# Altium schematic sheet PLL.SchDoc
size 420 x 297 mm; SheetNumber: 4; SheetTotal: 6
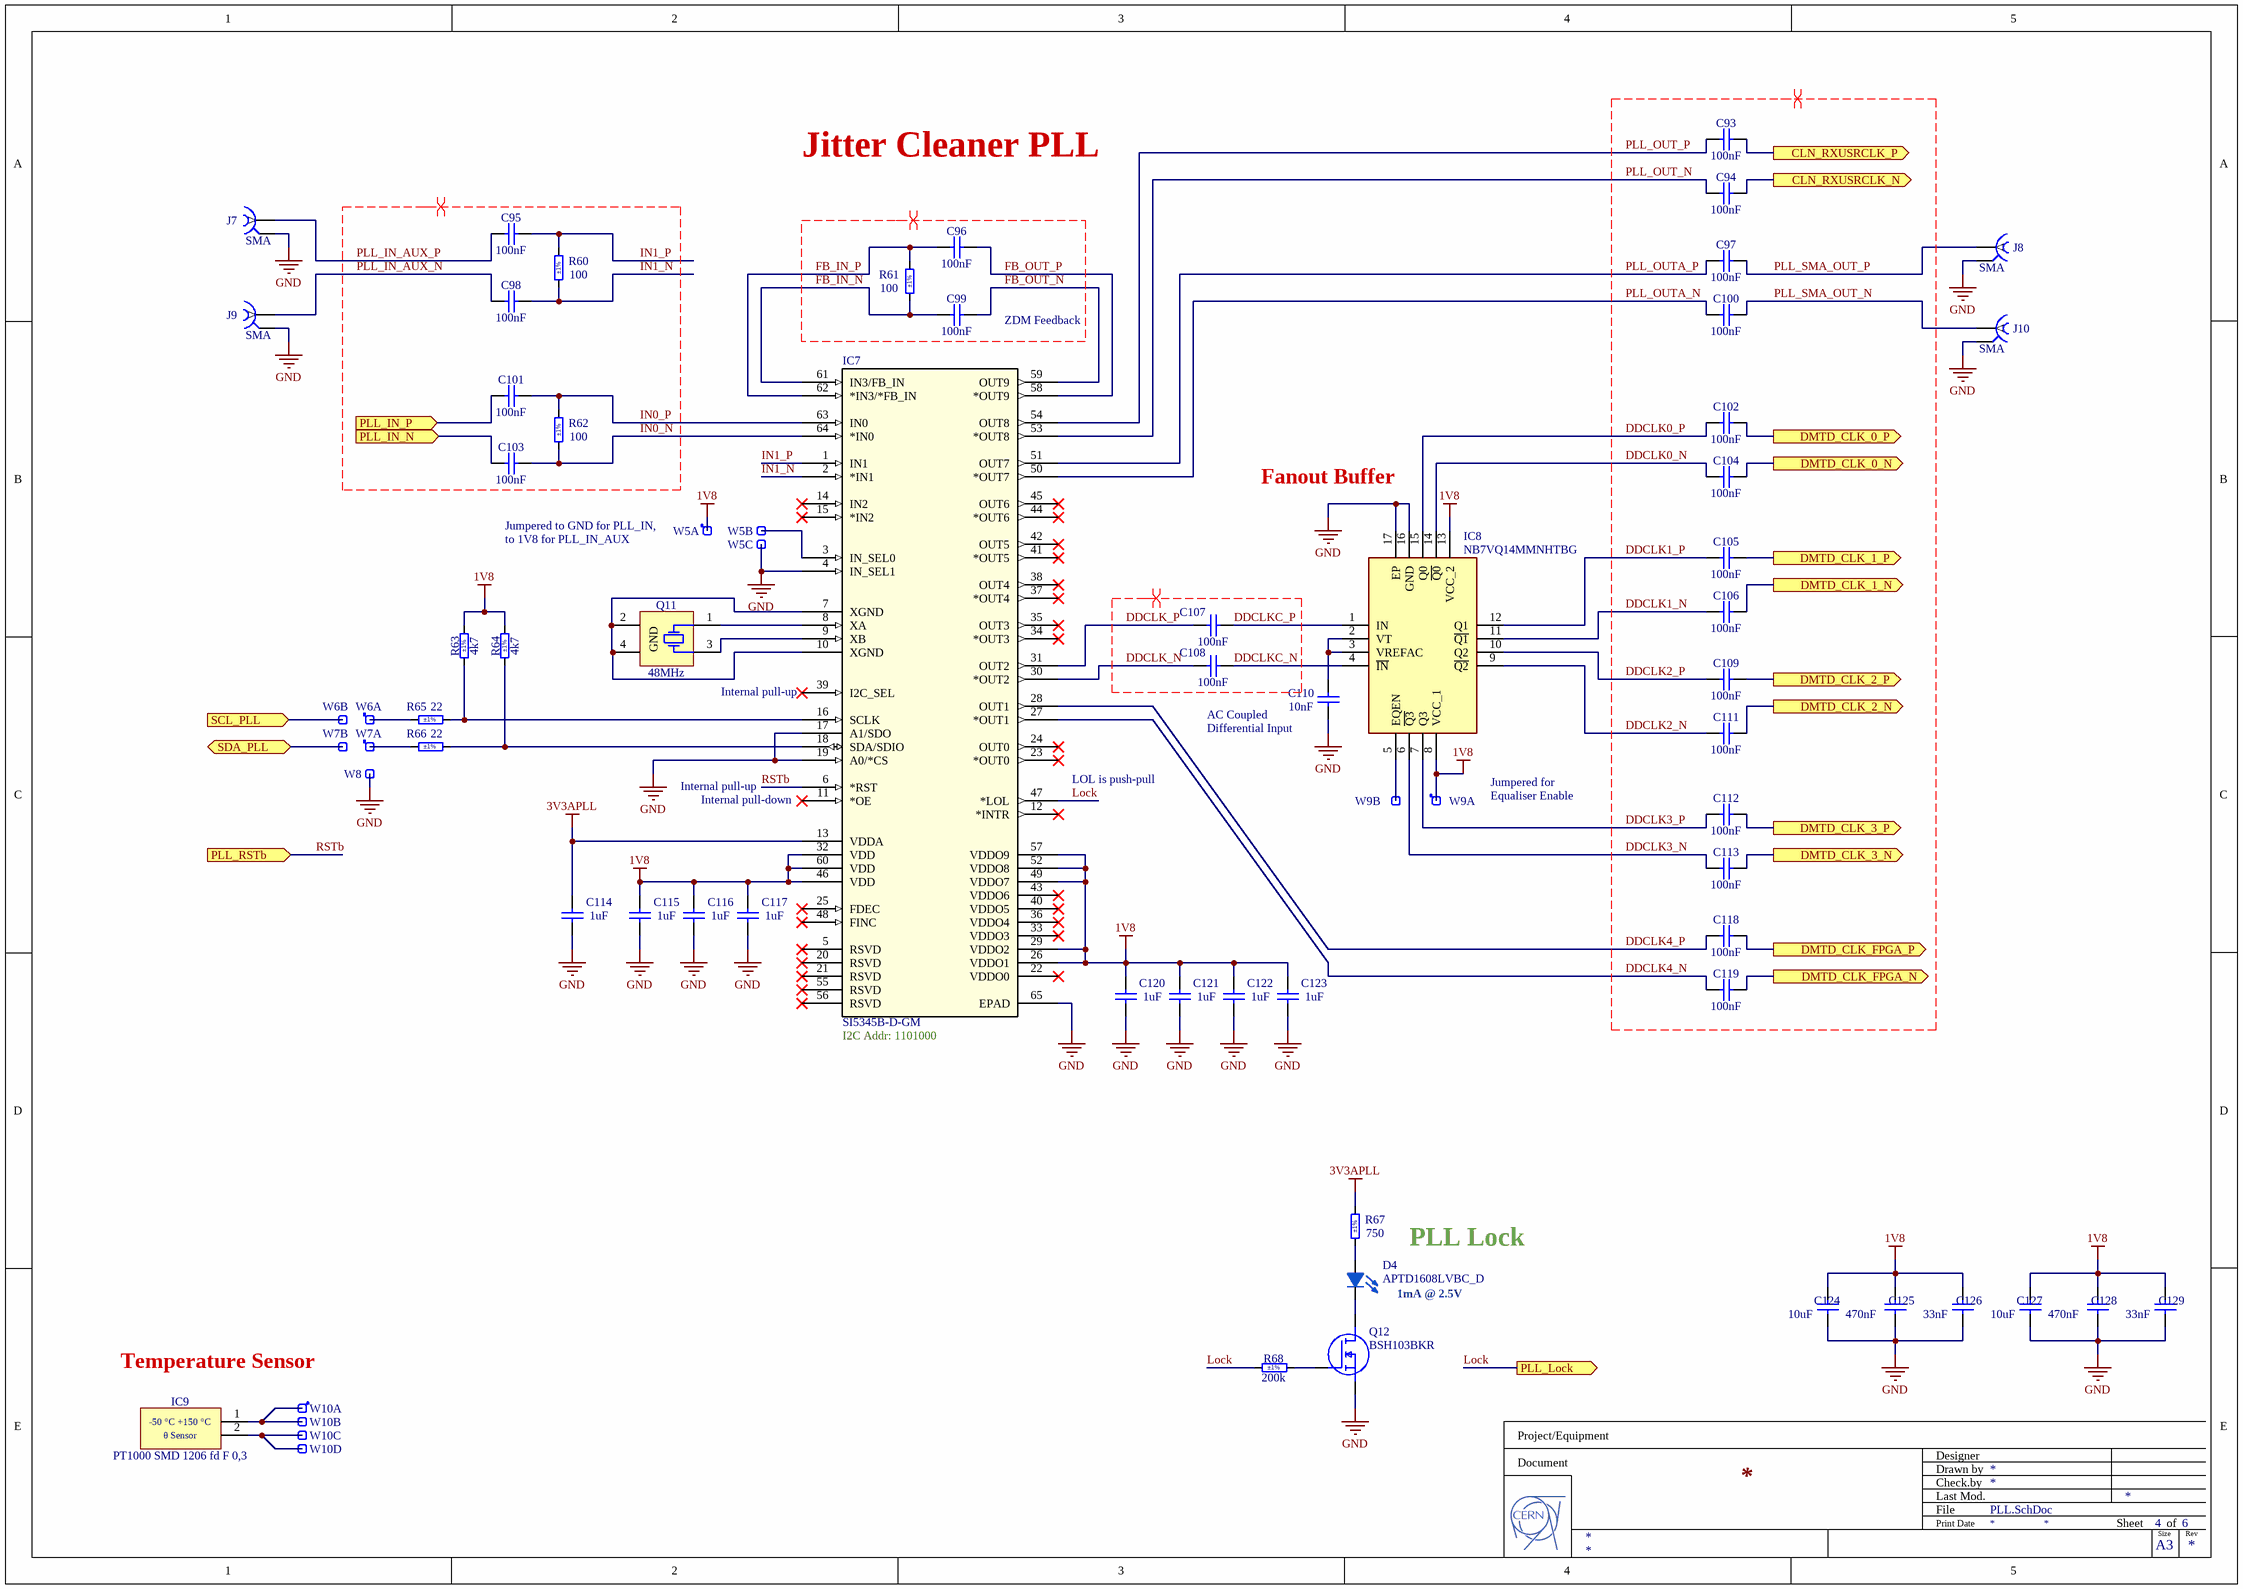
[diagram p0: PLL.SchDoc]

## Parts
C93  100nF  [CAPC0603X33N]
C94  100nF  [CAPC0603X33N]
C95  100nF  [CAPC0603X33N]
C96  100nF  [CAPC0603X33N]
C97  100nF  [CAPC0603X33N]
C98  100nF  [CAPC0603X33N]
C99  100nF  [CAPC0603X33N]
C100  100nF  [CAPC0603X33N]
C101  100nF  [CAPC0603X33N]
C102  100nF  [CAPC0603X33N]
C103  100nF  [CAPC0603X33N]
C104  100nF  [CAPC0603X33N]
C105  100nF  [CAPC0603X33N]
C106  100nF  [CAPC0603X33N]
C107  100nF  [CAPC0603X33N]
C108  100nF  [CAPC0603X33N]
C109  100nF  [CAPC0603X33N]
C110  10nF  [CAPC0603X33N]
C111  100nF  [CAPC0603X33N]
C112  100nF  [CAPC0603X33N]
C113  100nF  [CAPC0603X33N]
C114  1uF  [CAPC1005X55N]
C115  1uF  [CAPC1005X55N]
C116  1uF  [CAPC1005X55N]
C117  1uF  [CAPC1005X55N]
C118  100nF  [CAPC0603X33N]
C119  100nF  [CAPC0603X33N]
C120  1uF  [CAPC1005X55N]
C121  1uF  [CAPC1005X55N]
C122  1uF  [CAPC1005X55N]
C123  1uF  [CAPC1005X55N]
C124  10uF  [CAPC1608X87N]
C125  470nF  [CAPC0510X04N]
C126  33nF  [LLL03TR61E333KE01]
C127  10uF  [CAPC1608X87N]
C128  470nF  [CAPC0510X04N]
C129  33nF  [LLL03TR61E333KE01]
D4  APTD1608LVBC_D  [LEDC1608X110N]
IC7  SI5345B-D-GM  [QFN50P900X900X90-65N-D]
IC8  NB7VQ14MMNHTBG  [QFN50P300X300X100-17N]
IC9  PT1000 SMD 1206 fd F 0,3  [DFN310X150X55-2N]
J7  SMA  [SAMTEC_SMA-J-P-H-ST-MT1]
J8  SMA  [SAMTEC_SMA-J-P-H-ST-MT1]
J9  SMA  [SAMTEC_SMA-J-P-H-ST-MT1]
J10  SMA  [SAMTEC_SMA-J-P-H-ST-MT1]
Q11  48MHz  [XTAL_KYOCERA_CX3225SB]
Q12  BSH103BKR  [SOT95P230X110-3N]
R60  100  Tolerance: ±1%  [RESC0603X28N]
R61  100  Tolerance: ±1%  [RESC0603X28N]
R62  100  Tolerance: ±1%  [RESC0603X28N]
R63  4k7  Tolerance: ±1%  [RESC1005X40N]
R64  4k7  Tolerance: ±1%  [RESC1005X40N]
R65  22  Tolerance: ±1%  [RESC1005X40N]
R66  22  Tolerance: ±1%  [RESC1005X40N]
R67  750  Tolerance: ±1%  [RESC1005X40N]
R68  200k  Tolerance: ±1%  [RESC1005X40N]
W5  Header 3  [SAMTEC_HTSW-103-23-L-S]  (value not drawn)  (parts A,B,C of 3)
W6  Header 2  [SAMTEC_HTSW-102-23-L-S]  (value not drawn)  (parts A,B of 2)
W7  Header 2  [SAMTEC_HTSW-102-23-L-S]  (value not drawn)  (parts A,B of 2)
W8  Header 1  [SAMTEC_HTSW-101-23-L-S]  (value not drawn)
W9  Header 2  [SAMTEC_HTSW-102-23-L-S]  (value not drawn)  (parts A,B of 2)
W10  Header 4  [SAMTEC_HTSW-104-23-L-S]  (value not drawn)  (parts A,B,C,D of 4)

## Ports
CLN_RXUSRCLK_N (out), CLN_RXUSRCLK_P (out), DMTD_CLK_0_N (out), DMTD_CLK_0_P (out), DMTD_CLK_1_N (out), DMTD_CLK_1_P (out), DMTD_CLK_2_N (out), DMTD_CLK_2_P (out), DMTD_CLK_3_N (out), DMTD_CLK_3_P (out), DMTD_CLK_FPGA_N (out), DMTD_CLK_FPGA_P (out), PLL_IN_N (in), PLL_IN_P (in), PLL_Lock (out), PLL_RSTb (in), SCL_PLL (in), SDA_PLL (bidir)

## Nets
1V8: C115.2 C116.2 C117.2 C120.2 C121.2 C122.2 C123.2 C124.2 C125.2 C126.2 C127.2 C128.2 C129.2 IC7.26(VDDO1) IC7.29(VDDO2) IC7.32(VDD) IC7.46(VDD) IC7.49(VDDO7) IC7.52(VDDO8) IC7.57(VDDO9) IC7.60(VDD) IC8.8(VCC_1) IC8.13(VCC_2) R63.2 R64.2 W5.1 W9.1
3V3APLL: C114.2 IC7.13(VDDA) R67.2
GND: C110.1 C114.1 C115.1 C116.1 C117.1 C120.1 C121.1 C122.1 C123.1 C124.1 C125.1 C126.1 C127.1 C128.1 C129.1 IC7.4(IN_SEL1) IC7.17(A1/SDO) IC7.19(A0/*CS) IC7.65(EPAD) IC8.16(GND) IC8.17(EP) J7.2 J8.2 J9.2 J10.2 Q12.2(S) W5.3 W8.1
CLN_RXUSRCLK_N: C94.2 ; port CLN_RXUSRCLK_N
CLN_RXUSRCLK_P: C93.2 ; port CLN_RXUSRCLK_P
DDCLK0_N: C104.1 IC8.14(~{Q0})
DDCLK0_P: C102.1 IC8.15(Q0)
DDCLK1_N: C106.1 IC8.11(~{Q1})
DDCLK1_P: C105.1 IC8.12(Q1)
DDCLK2_N: C111.1 IC8.9(~{Q2})
DDCLK2_P: C109.1 IC8.10(Q2)
DDCLK3_N: C113.1 IC8.6(~{Q3})
DDCLK3_P: C112.1 IC8.7(Q3)
DDCLK4_N: C119.1 IC7.27(*OUT1)
DDCLK4_P: C118.1 IC7.28(OUT1)
DDCLK_N: C108.1 IC7.30(*OUT2)
DDCLK_P: C107.1 IC7.31(OUT2)
DDCLKC_N: C108.2 IC8.4(~{IN})
DDCLKC_P: C107.2 IC8.1(IN)
DMTD_CLK_0_N: C104.2 ; port DMTD_CLK_0_N
DMTD_CLK_0_P: C102.2 ; port DMTD_CLK_0_P
DMTD_CLK_1_N: C106.2 ; port DMTD_CLK_1_N
DMTD_CLK_1_P: C105.2 ; port DMTD_CLK_1_P
DMTD_CLK_2_N: C111.2 ; port DMTD_CLK_2_N
DMTD_CLK_2_P: C109.2 ; port DMTD_CLK_2_P
DMTD_CLK_3_N: C113.2 ; port DMTD_CLK_3_N
DMTD_CLK_3_P: C112.2 ; port DMTD_CLK_3_P
DMTD_CLK_FPGA_N: C119.2 ; port DMTD_CLK_FPGA_N
DMTD_CLK_FPGA_P: C118.2 ; port DMTD_CLK_FPGA_P
FB_IN_N: C99.1 IC7.61(IN3/FB_IN) R61.1
FB_IN_P: C96.1 IC7.62(*IN3/*FB_IN) R61.2
FB_OUT_N: C99.2 IC7.59(OUT9)
FB_OUT_P: C96.2 IC7.58(*OUT9)
IN0_N: C103.1 IC7.64(*IN0) R62.1
IN0_P: C101.1 IC7.63(IN0) R62.2
IN1_N: C98.1 IC7.2(*IN1) R60.1
IN1_P: C95.1 IC7.1(IN1) R60.2
Lock: IC7.47(*LOL) R68.1 ; port PLL_Lock
PLL_IN_AUX_N: C98.2 J9.1
PLL_IN_AUX_P: C95.2 J7.1
PLL_IN_N: C103.2 ; port PLL_IN_N
PLL_IN_P: C101.2 ; port PLL_IN_P
PLL_OUT_N: C94.1 IC7.53(*OUT8)
PLL_OUT_P: C93.1 IC7.54(OUT8)
PLL_OUTA_N: C100.1 IC7.50(*OUT7)
PLL_OUTA_P: C97.1 IC7.51(OUT7)
PLL_SMA_OUT_N: C100.2 J10.1
PLL_SMA_OUT_P: C97.2 J8.1
RSTb: IC7.6(*RST) ; port PLL_RSTb
SCL_PLL: W6.2 ; port SCL_PLL
SDA_PLL: W7.2 ; port SDA_PLL
NetC110_2: C110.2 IC8.2(VT) IC8.3(VREFAC)
NetD4_1: D4.1(C) Q12.3(D)
NetD4_2: D4.2(A) R67.1
NetIC7_3: IC7.3(IN_SEL0) W5.2
NetIC7_7: IC7.7(XGND) IC7.10(XGND) Q11.2(GND) Q11.4(GND)
NetIC7_8: IC7.8(XA) Q11.1(X)
NetIC7_9: IC7.9(XB) Q11.3(X)
NetIC7_16: IC7.16(SCLK) R63.1 R65.2
NetIC7_18: IC7.18(SDA/SDIO) R64.1 R66.2
NetIC8_5: IC8.5(EQEN) W9.2
NetIC9_1: IC9.1 W10.1 W10.2
NetIC9_2: IC9.2 W10.3 W10.4
NetQ12_1: Q12.1(G) R68.2
NetR65_1: R65.1 W6.1
NetR66_1: R66.1 W7.1

Not connected (* = marked no-connect by the designer): IC7 5(RSVD)* 11(*OE)* 12(*INTR)* 14(IN2)* 15(*IN2)* 20(RSVD)* 21(RSVD)* 22(VDDO0)* 23(*OUT0)* 24(OUT0)* 25(FDEC)* 33(VDDO3)* 34(*OUT3)* 35(OUT3)* 36(VDDO4)* 37(*OUT4)* 38(OUT4)* 39(I2C_SEL)* 40(VDDO5)* 41(*OUT5)* 42(OUT5)* 43(VDDO6)* 44(*OUT6)* 45(OUT6)* 48(FINC)* 55(RSVD)* 56(RSVD)*

## Layout directives
differential pair: DDCLK0_N, DDCLK0_P, DDCLK1_N, DDCLK1_P, DDCLK2_N, DDCLK2_P, DDCLK3_N, DDCLK3_P, DDCLK4_N, DDCLK4_P, DDCLK_N, DDCLK_P, DDCLKC_N, DDCLKC_P, FB_IN_N, FB_IN_P, FB_OUT_N, FB_OUT_P, IN0_N, IN0_P, IN1_N, IN1_P, PLL_IN_AUX_N, PLL_IN_AUX_P, PLL_OUT_N, PLL_OUT_P, PLL_OUTA_N, PLL_OUTA_P, PLL_SMA_OUT_N, PLL_SMA_OUT_P

## Notes on the sheet
- Jitter Cleaner PLL
- ZDM Feedback
- Fanout Buffer
- Jumpered to GND for PLL_IN, to 1V8 for PLL_IN_AUX
- (near IC7) Internal pull-up
- AC Coupled
  Differential Input
- Internal pull-up
- (near IC7) Internal pull-down
- LOL is push-pull
- Jumpered for Equaliser Enable
- (near IC7) I2C Addr: 1101000
- PLL Lock
- 1mA @ 2.5V
- Temperature Sensor
- Project/Equipment
- Document
- Designer
- Drawn by
- Check.by
- File
- Last Mod.
- Print Date
- Sheet
- Size
- A3
- of
- Rev
- (in symbol PT1000 SMD 1206 fd F 0,3) -50 °C +150 °C; θ Sensor

## Library data of the parts
C93-C109 C111-C113 C118 C119 = CC0201_100NF_6.3V_10%_X7R: Non-polarised capacitor; Part Description: SMD Multilayer Chip Ceramic Capacitor; Manufacturer: GENERIC; Manufacturer1 Part Number: CC0201KRX7R5BB104; Voltage: 6.3V; TC: X7R; Tolerance: ±10%; Part Number: CC0201_100NF_6.3V_10%_X7R; Component Kind: Standard; Component Type: Standard; Pin Count: 2; Value: 100nF; Status: Not Recommended; Manufacturer Part Number: CC0201_100NF_6.3V_10%_X7R; Case: 0201; Mounted: Yes; Socket: No; SMD: Yes; Sense: No; Manufacturer1 Example: YAGEO PHYCOMP; Manufacturer1 ComponentHeight: 0.33mm; HelpURL: \\cern.ch\dfs\Applications\Altium\Datasheets\CC0201_X7R_YAGEO_6.3VTO50V.pdf; Author: CERN DEM BC; CreateDate: 11/20/2020; LatestRevisionDate: 11/20/2020
C110 = CC0201_10NF_10V_10%_X5R: Non-polarised capacitor; Part Description: SMD Multilayer Chip Ceramic Capacitor; Manufacturer: GENERIC; Manufacturer1 Part Number: 0201ZD103KAT2A; Voltage: 10V; TC: X5R; Tolerance: ±10%; Part Number: CC0201_10NF_10V_10%_X5R; Component Kind: Standard; Component Type: Standard; Pin Count: 2; Value: 10nF; Status: Not Recommended; Manufacturer Part Number: CC0201_10NF_10V_10%_X5R; Case: 0201; Mounted: Yes; Socket: No; SMD: Yes; Sense: No; Manufacturer1 Example: AVX; Manufacturer1 ComponentHeight: 0.33mm; HelpURL: \\cern.ch\dfs\Applications\Altium\Datasheets\CC0201_X5R_AVX.pdf; Author: CERN DEM JLC; CreateDate: 12/3/2007; LatestRevisionDate: 12/3/2007
C114-C117 C120-C123 = CC0402_1UF_16V_10%_X5R: GRM153B30J105ME15; Part Description: SMD Multilayer Chip Ceramic Capacitor; Manufacturer: GENERIC; Manufacturer1 Part Number: C1005X5R1C105KT; Voltage: 16V; TC: X5R; Tolerance: ±10%; Part Number: CC0402_1UF_16V_10%_X5R; Component Kind: Standard; Component Type: Standard; Pin Count: 2; Value: 1uF; Status: Preferred; Manufacturer Part Number: CC0402_1UF_16V_10%_X5R; Case: 0402; Mounted: Yes; Socket: No; SMD: Yes; Sense: No; Manufacturer1 Example: TDK; Manufacturer1 ComponentHeight: 0.55mm; HelpURL: \\cern.ch\dfs\Applications\Altium\Datasheets\CC0402_X5R_TDK_C.pdf; Author: CERN DEM JLC; CreateDate: 10/25/2012; LatestRevisionDate: 10/25/2012
C124 C127 = CC0603_10UF_6.3V_20%_X5R: GRM188D71A106KA73; Part Description: SMD Multilayer Chip Ceramic Capacitor; Manufacturer: GENERIC; Manufacturer1 Part Number: C0603C106M9PAC; Voltage: 6.3V; TC: X5R; Tolerance: ±20%; Part Number: CC0603_10UF_6.3V_20%_X5R; Component Kind: Standard; Component Type: Standard; Pin Count: 2; Value: 10uF; Status: Preferred; Manufacturer Part Number: CC0603_10uF_6.3V_20%_X5R; Case: 0603; Mounted: Yes; Socket: No; SMD: Yes; Sense: No; Manufacturer1 Example: KEMET; Manufacturer1 ComponentHeight: 0.95mm; HelpURL: \\cern.ch\dfs\Applications\Altium\Datasheets\CC0603_X5R_KEMET.pdf; Author: CERN DEM JLC; CreateDate: 03/12/2007; LatestRevisionDate: 03/12/2007
C125 C128 = Capacitor - non polarized: LLL153C70G474ME17; Value: 470nF
C126 C129 = Capacitor - non polarized: LLL03TR61E333KE01; Value: 33nF
D4 = APTD1608LVBC_D: Led Blue 0603 2mA 2.65V 65mcd 120mW; Manufacturer_Name: Kingbright; Manufacturer_Part_Number: APTD1608LVBC/D; Geometry.Height: 1.1mm; Mouser Part Number: 604-APTD1608LVBCD; Mouser Price/Stock: https://www.mouser.co.uk/ProductDetail/Kingbright/APTD1608LVBC-D?qs=6oMev5NRZMEfNSg5xIhlKA%3D%3D; Datasheet Link: https://componentsearchengine.com/Datasheets/1/APTD1608LVBC_D.pdf
IC7 = SI5345B-D-GM: Integrated Circuit; Manufacturer_Name: Skyworks; Datasheet Link: https://www.mouser.sg/datasheet/2/472/si5345_44_42_d_datasheet-2507675.pdf; Height: 0.9mm; Manufacturer_Part_Number: SI5345B-D-GM; Mouser Part Number: 634-SI5345B-D-GM; Mouser Price/Stock: https://www.mouser.co.uk/ProductDetail/Skyworks-Solutions-Inc/SI5345B-D-GM?qs=p9T7GgSe1IGHqFUKlxUKrA%3D%3D
IC8 = NB7VQ14MMNHTBG: Integrated Circuit; Manufacturer_Name: onsemi; Datasheet Link: http://www.onsemi.com/pub/Collateral/NB7VQ14M-D.PDF; Height: 1mm; Manufacturer_Part_Number: NB7VQ14MMNHTBG; Mouser Part Number: 863-NB7VQ14MMNHTBG; Mouser Price/Stock: https://www.mouser.co.uk/ProductDetail/onsemi/NB7VQ14MMNHTBG?qs=3PKVEWFFm2%2FWq%2FFZ4xstfg%3D%3D; Arrow Part Number: NB7VQ14MMNHTBG; Arrow Price/Stock: https://www.arrow.com/en/products/nb7vq14mmnhtbg/on-semiconductor?utm_currency=USD&region=nac
IC9 = PT1000 SMD 1206 fd F 0,3: 2 Pin Temperature Sensor; Part Description: -50°C to +150°C, 1000 Ohm at 0°C Platinum Temperature Sensor; Manufacturer: UMWELTSENSORTECHNIK GmbH (UST); PressFit: No; Bonding: No; Part Number: PT1000 SMD 1206 fd F 0,3; Component Kind: Standard; Component Type: Standard; Device: PT1000 SMD 1206 fd F 0,3; PackageDescription: DFN; 2 Pin,3.10mm L X 1.50mm W X 0.40mm H, IPC Medium Density; Manufacturer Part Number: PT1000 SMD 1206 fd F 0,3; Pin Count: 2; Case: DFN2; Mounted: Yes; Socket: No; SMD: Yes; Sense: No; ComponentHeight: 0.55mm; HelpURL: \\cern.ch\dfs\Applications\Altium\Datasheets\PT1000 SMD 1206 fd.pdf; Author: CERN DEM JLC; CreateDate: 8/20/2018; LatestRevisionDate: 8/22/2018
J7-J10 = SAMTEC_SMA-J-P-H-ST-MT1: Part Description: 50 Ohms SMA Straight Mixed Technology PCB Jack; Manufacturer: SAMTEC; PressFit: No; Sense Comment: assembly limitations; Part Number: SAMTEC_SMA-J-P-H-ST-MT1; Component Kind: Standard; Component Type: Standard; Pin Count: 5; Family: SMA; Mounted: Yes; Socket: No; SMD: Yes; Sense: Yes; Status: Not Recommended; Manufacturer Part Number: SMA-J-P-H-ST-MT1; ComponentHeight: 7.95mm; HelpURL: \\cern.ch\dfs\Applications\Altium\Datasheets\SAMTEC_SMA-J-P-H-ST-MT1.pdf; Author: CERN DEM HF; CreateDate: 5/24/2023; LatestRevisionDate: 5/24/2023
Q11 = XTAL_48MHZ_KYOCERA_CX3225SB48000D0FPJC1: Crystal 4 pins 1=XTAL Control 2=GND3=XTAL 4=GND; Part Description: Tolerance: ±10ppm, Stability: ±15ppm, 8pF, -40°C to +85°C, Surface Mount Crystal; PressFit: No; Bonding: No; Part Number: XTAL_48MHZ_KYOCERA_CX3225SB48000D0FPJC1; Component Kind: Standard; Component Type: Standard; PackageDescription: SMD Crystal Kyocera, 4 Pins, 2.50mm L X 3.20mm W X 0.6mm H; Value: 48MHz; Manufacturer: KYOCERA; Manufacturer Part Number: CX3225SB48000D0FPJC1; Pin Count: 4; Mounted: Yes; Socket: No; SMD: Yes; Sense: No; ComponentHeight: 0.6mm; HelpURL: \\cern.ch\dfs\Applications\Altium\Datasheets\XTAL_KYOCERA_CX3225SB.pdf; Author: CERN DEM JLC; CreateDate: 6/5/2018; LatestRevisionDate: 6/5/2018
Q12 = BSH103BKR: MOSFET (N-Channel); Manufacturer_Name: Nexperia; Datasheet Link: https://ms.componentsearchengine.com/Datasheets/2/BSH103BKR.pdf; Height: 1.1mm; Manufacturer_Part_Number: BSH103BKR; Mouser Part Number: 771-BSH103BKR; Mouser Price/Stock: https://www.mouser.co.uk/ProductDetail/Nexperia/BSH103BKR?qs=GCAb4wyKXLKD%2FWt2ta8c7Q%3D%3D; Arrow Part Number: BSH103BKR; Arrow Price/Stock: https://www.arrow.com/en/products/bsh103bkr/nexperia?region=europe
R60-R62 = R0201_100R_1%_0.05W_200PPM: Resistor - 1%; Part Description: Thick Film Chip Resistor; Manufacturer: GENERIC; Manufacturer1 Part Number: CRCW0201100RFNED; Power: 0.05W; TC: ±200ppm/°C; PressFit: No; Part Number: R0201_100R_1%_0.05W_200PPM; Component Kind: Standard; Component Type: Standard; Pin Count: 2; Value: 100; Status: Not Recommended; Manufacturer Part Number: R0201_100R_1%_0.05W_200PPM; Case: 0201; Mounted: Yes; Sense: No; Socket: No; SMD: Yes; Manufacturer1 Example: VISHAY; Manufacturer1 ComponentHeight: 0.27mm; HelpURL: \\cern.ch\dfs\Applications\Altium\Datasheets\R0201_VISHAY_CRCW e3.pdf; Author: CERN DEM JLC; CreateDate: 11/13/2014; LatestRevisionDate: 11/13/2014
R63 R64 = R0402_4K7_1%_0.0625W_100PPM: Resistor - 1%; Part Description: General Purpose Thick Film Chip Resistor; Manufacturer: GENERIC; Manufacturer1 Part Number: 232270674702L; TC: ±100ppm/°C; PressFit: No; Part Number: R0402_4K7_1%_0.0625W_100PPM; Component Kind: Standard; Component Type: Standard; Pin Count: 2; Value: 4k7; Status: Not Recommended; Power: 0.0625W; Manufacturer Part Number: R0402_4K7_1%_0.0625W_100PPM; Case: 0402; Mounted: Yes; Sense: No; Socket: No; SMD: Yes; Manufacturer1 Example: YAGEO PHYCOMP; Manufacturer1 ComponentHeight: 0.4mm; HelpURL: \\cern.ch\dfs\Applications\Altium\Datasheets\R0402_Phycomp_RC0402.pdf; Author: CERN DEM JLC; CreateDate: 12/3/2007; LatestRevisionDate: 10/17/2012
R65 R66 = R0402_22R_1%_0.0625W_100PPM: Resistor - 1%; Part Description: General Purpose Thick Film Chip Resistor; Manufacturer: GENERIC; Manufacturer1 Part Number: 232270672209L; TC: ±100ppm/°C; PressFit: No; Part Number: R0402_22R_1%_0.0625W_100PPM; Component Kind: Standard; Component Type: Standard; Pin Count: 2; Value: 22; Status: Not Recommended; Power: 0.0625W; Manufacturer Part Number: R0402_22R_1%_0.0625W_100PPM; Case: 0402; Mounted: Yes; Sense: No; Socket: No; SMD: Yes; Manufacturer1 Example: YAGEO PHYCOMP; Manufacturer1 ComponentHeight: 0.4mm; HelpURL: \\cern.ch\dfs\Applications\Altium\Datasheets\R0402_Phycomp_RC0402.pdf; Author: CERN DEM JLC; CreateDate: 12/3/2007; LatestRevisionDate: 10/17/2012
R67 = R0402_750R_1%_0.0625W_100PPM: Resistor - 1%; Part Description: General Purpose Thick Film Chip Resistor; Manufacturer: GENERIC; Manufacturer1 Part Number: 232270677501L; TC: ±100ppm/°C; PressFit: No; Part Number: R0402_750R_1%_0.0625W_100PPM; Component Kind: Standard; Component Type: Standard; Pin Count: 2; Value: 750; Status: Not Recommended; Power: 0.0625W; Manufacturer Part Number: R0402_750R_1%_0.0625W_100PPM; Case: 0402; Mounted: Yes; Sense: No; Socket: No; SMD: Yes; Manufacturer1 Example: YAGEO PHYCOMP; Manufacturer1 ComponentHeight: 0.4mm; HelpURL: \\cern.ch\dfs\Applications\Altium\Datasheets\R0402_Phycomp_RC0402.pdf; Author: CERN DEM JLC; CreateDate: 12/3/2007; LatestRevisionDate: 10/17/2012
R68 = R0402_200K_1%_0.0625W_100PPM: Resistor - 1%; Part Description: General Purpose Thick Film Chip Resistor; Manufacturer: GENERIC; Manufacturer1 Part Number: 232270672004L; TC: ±100ppm/°C; PressFit: No; Part Number: R0402_200K_1%_0.0625W_100PPM; Component Kind: Standard; Component Type: Standard; Pin Count: 2; Value: 200k; Status: Not Recommended; Power: 0.0625W; Manufacturer Part Number: R0402_200K_1%_0.0625W_100PPM; Case: 0402; Mounted: Yes; Sense: No; Socket: No; SMD: Yes; Manufacturer1 Example: YAGEO PHYCOMP; Manufacturer1 ComponentHeight: 0.4mm; HelpURL: \\cern.ch\dfs\Applications\Altium\Datasheets\R0402_Phycomp_RC0402.pdf; Author: CERN DEM JLC; CreateDate: 12/3/2007; LatestRevisionDate: 10/17/2012
W5 = SAMTEC_HTSW-103-23-L-S: 3 Mini Wire-Wrap Contact Strip Header; Part Description: 3 Contacts, Pitch 2.54mm, Single Row Through Mount Straight Header (Post Lead 5.84mm, Tail Lead 2.92mm, Insulator 2.54mm); Manufacturer: SAMTEC; PressFit: No; Status Comment: High Temperature; Part Number: SAMTEC_HTSW-103-23-L-S; Component Kind: Standard; Component Type: Standard; Pin Count: 3; Family: Header 3; Mounted: Yes; Socket: No; SMD: No; Sense: No; Status: Preferred; Manufacturer Part Number: HTSW-103-23-L-S; ComponentHeight: 8.38mm; HelpURL: \\cern.ch\dfs\Applications\Altium\Datasheets\SAMTEC_HTSW-103-23-L-S.pdf; Author: CERN DEM JLC; CreateDate: 2/22/2018; LatestRevisionDate: 2/22/2018
W6 W7 W9 = SAMTEC_HTSW-102-23-L-S: 2 Mini Wire-Wrap Contact Strip Header; Part Description: 2 Contacts, Pitch 2.54mm, Single Row  Through Mount Straight Header (Post Lead 5.84mm, Tail Lead 2.92mm, Insulator 2.54mm); Manufacturer: SAMTEC; PressFit: No; Status Comment: High Temperature; Part Number: SAMTEC_HTSW-102-23-L-S; Component Kind: Standard; Component Type: Standard; Pin Count: 2; Family: Header 2; Mounted: Yes; Socket: No; SMD: No; Sense: No; Status: Preferred; Manufacturer Part Number: HTSW-102-23-L-S; ComponentHeight: 8.38mm; HelpURL: \\cern.ch\dfs\Applications\Altium\Datasheets\SAMTEC_HTSW-102-23-L-S.pdf; Author: CERN DEM JLC; CreateDate: 2/22/2018; LatestRevisionDate: 2/22/2018
W8 = SAMTEC_HTSW-101-23-L-S: Single Mini Wire-Wrap Contact; Part Description: Single Contact Through Mount Straight Header (Post Lead 5.84mm, Tail Lead 2.92mm, Insulator 2.54mm); Manufacturer: SAMTEC; PressFit: No; Status Comment: High Temperature; Part Number: SAMTEC_HTSW-101-23-L-S; Component Kind: Standard; Component Type: Standard; Pin Count: 1; Family: Header 1; Mounted: Yes; Socket: No; SMD: No; Sense: No; Status: Preferred; Manufacturer Part Number: HTSW-101-23-L-S; ComponentHeight: 8.38mm; HelpURL: \\cern.ch\dfs\Applications\Altium\Datasheets\SAMTEC_HTSW-101-23-L-S.pdf; Author: CERN DEM JLC; CreateDate: 2/22/2018; LatestRevisionDate: 2/22/2018
W10 = SAMTEC_HTSW-104-23-L-S: 4 Mini Wire-Wrap Contact Strip Header; Part Description: 4 Contacts, Pitch 2.54mm, Single Row  Through Mount Straight Header (Post Lead 5.84mm, Tail Lead 2.92mm, Insulator 2.54mm); Manufacturer: SAMTEC; PressFit: No; Status Comment: High Temperature; Part Number: SAMTEC_HTSW-104-23-L-S; Component Kind: Standard; Component Type: Standard; Pin Count: 4; Family: Header 4; Mounted: Yes; Socket: No; SMD: No; Sense: No; Status: Preferred; Manufacturer Part Number: HTSW-104-23-L-S; ComponentHeight: 8.38mm; HelpURL: \\cern.ch\dfs\Applications\Altium\Datasheets\SAMTEC_HTSW-104-23-L-S.pdf; Author: CERN DEM JLC; CreateDate: 2/22/2018; LatestRevisionDate: 2/22/2018